# EAGLE schematic mubi-ESP32-38 (EAGLE 7.2.0)
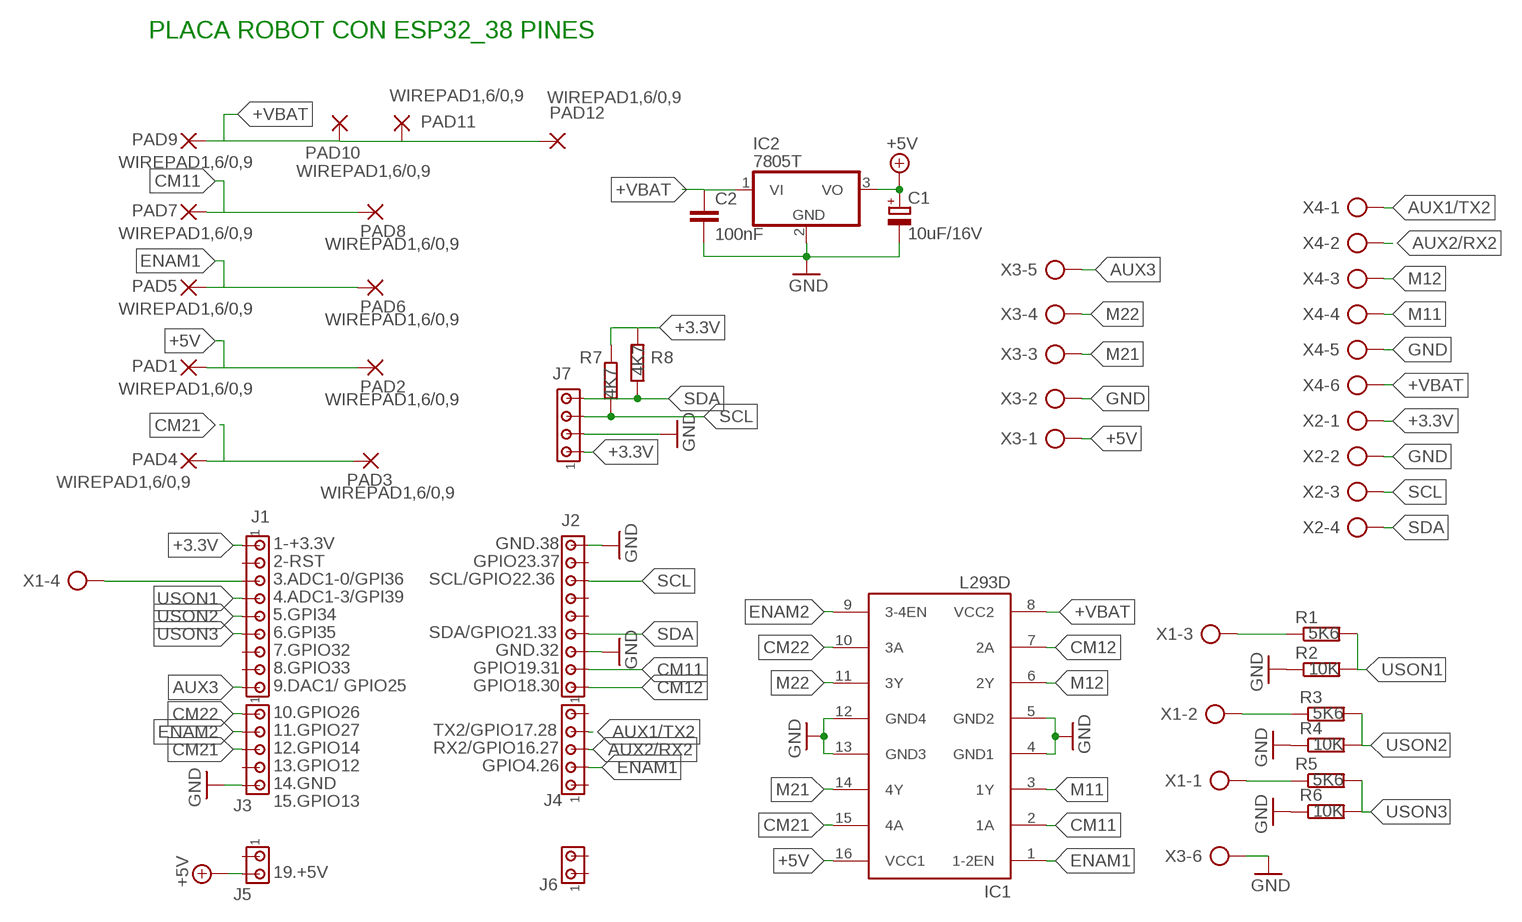
[diagram p0: schematic, sheet 1]

## Parts
C1  10uF/16V  CPOL-EUE2.5-6  [E2,5-6]
C2  100nF  C-EU025-025X050  [C025-025X050]
IC1  L293D  [DIL16]
IC2  7805T  [TO220H]
J1  MTA09-100  [10X09MTA]
J2  MTA09-100  [10X09MTA]
J3  MTA05-100  [10X05MTA]
J4  MTA05-100  [10X05MTA]
J5  MTA02-100  [10X02MTA]
J6  MTA02-100  [10X02MTA]
J7  MTA04-100  [10X04MTA]
PAD1  WIREPAD1,6/0,9  [1,6/0,9]
PAD2  WIREPAD1,6/0,9  [1,6/0,9]
PAD3  WIREPAD1,6/0,9  [1,6/0,9]
PAD4  WIREPAD1,6/0,9  [1,6/0,9]
PAD5  WIREPAD1,6/0,9  [1,6/0,9]
PAD6  WIREPAD1,6/0,9  [1,6/0,9]
PAD7  WIREPAD1,6/0,9  [1,6/0,9]
PAD8  WIREPAD1,6/0,9  [1,6/0,9]
PAD9  WIREPAD1,6/0,9  [1,6/0,9]
PAD10  WIREPAD1,6/0,9  [1,6/0,9]
PAD11  WIREPAD1,6/0,9  [1,6/0,9]
PAD12  WIREPAD1,6/0,9  [1,6/0,9]
R1  5K6  R-EU_0204/5  [0204/5]
R2  10K  R-EU_0204/5  [0204/5]
R3  5K6  R-EU_0204/5  [0204/5]
R4  10K  R-EU_0204/5  [0204/5]
R5  5K6  R-EU_0204/5  [0204/5]
R6  10K  R-EU_0204/5  [0204/5]
R7  4K7  R-EU_0207/7  [0207/7]
R8  4K7  R-EU_0207/7  [0207/7]
X1  AK500/4-H  [AK500/4-H]
X2  AK500/4-H  [AK500/4-H]
X3  AK500/6-H  [AK500/6-H]
X4  AK500/6-H  [AK500/6-H]

## Nets
+3.3V: J1.1 J7.1 R7.2 R8.2 X2.1
+5V: C1.+ IC1.16(VCC1) IC2.3(VO) J5.2 PAD1.1(P) PAD2.1(P) X3.1
+VBAT: C2.1 IC1.8(VCC2) IC2.1(VI) PAD9.1(P) PAD10.1(P) PAD11.1(P) PAD12.1(P) X4.6
AUX1/TX2: J4.4 X4.1
AUX2/RX2: J4.3 X4.2
AUX3: J1.9 X3.5
CM11: IC1.2(1A) J2.2 PAD7.1(P) PAD8.1(P)
CM12: IC1.7(2A) J2.1
CM21: IC1.15(4A) J3.3 PAD3.1(P) PAD4.1(P)
CM22: IC1.10(3A) J3.1
ENAM1: IC1.1(1-2EN) J4.2 PAD5.1(P) PAD6.1(P)
ENAM2: IC1.9(3-4EN) J3.2
GND: C1.- C2.2 IC1.4(GND1) IC1.5(GND2) IC1.12(GND4) IC1.13(GND3) IC2.2(GND) J2.3 J2.9 J3.5 J7.2 R2.1 R4.1 R6.1 X2.2 X3.2 X3.6 X4.5
M11: IC1.3(1Y) X4.4
M12: IC1.6(2Y) X4.3
M21: IC1.14(4Y) X3.3
M22: IC1.11(3Y) X3.4
N$1: R1.1 X1.3
N$2: R3.1 X1.2
N$3: R5.1 X1.1
N$4: J1.3 X1.4
SCL: J2.7 J7.3 R7.1 X2.3
SDA: J2.4 J7.4 R8.1 X2.4
USON1: J1.4 R1.2 R2.2
USON2: J1.5 R3.2 R4.2
USON3: J1.6 R5.2 R6.2
Unconnected: J1.2 J1.7 J1.8 J2.5 J2.6 J2.8 J3.4 J4.1 J4.5 J5.1 J6.1 J6.2

## Notes on the sheet
- PLACA ROBOT CON ESP32_38 PINES
- 1-+3.3V | GND.38
- 2-RST | GPIO23.37
- 3.ADC1-0/GPI36 | SCL/GPIO22.36
- 4.ADC1-3/GPI39
- 5.GPI34
- 6.GPI35 | SDA/GPIO21.33
- 7.GPIO32 | GND.32
- 8.GPIO33 | GPIO19.31
- 9.DAC1/ GPIO25 | GPIO18.30
- 10.GPIO26
- 11.GPIO27 | TX2/GPIO17.28
- 12.GPIO14 | RX2/GPIO16.27
- 13.GPIO12 | GPIO4.26
- 14.GND
- 15.GPIO13
- 19.+5V

## Library data of the parts
C1 = resistor:CPOL-EU: POLARIZED CAPACITOR, European symbol
C2 = rcl:C-EU: CAPACITOR, European symbol
IC1 = st-microelectronics:L293D: PUSH-PULL 4 CHANNEL DRIVER; MPN: L293D; OC_FARNELL: 9589619; OC_NEWARK: 56P8249
IC2 = linear:78*: Positive VOLTAGE REGULATOR Source: http://cache.national.com/ds/LM/LM78L05.pdf http://www.fairchildsemi.com/ds/LM/LM7805.pdf
J1 J2 = con-amp:MTA09-100: AMP connector
J3 J4 = con-amp:MTA05-100: AMP connector
J5 J6 = con-amp:MTA02-100: AMP connector
J7 = con-amp:MTA04-100: AMP connector
PAD1-PAD12 = wirepad:WIREPAD: Wire PAD connect wire on PCB
R1-R8 = resistor:R-EU_: RESISTOR, European symbol
X1 X2 = con-ptr500:AK500/4-H: CONNECTOR Aug. 2004 / PTR Meßtechnik: Die Bezeichnung der Serie AK505 wurde geändert. Es handelt sich hierbei um AK500 in horizontaler Ausführung.; OC_FARNELL: unknown; OC_NEWARK: unknown
X3 X4 = con-ptr500:AK500/6-H: CONNECTOR Aug. 2004 / PTR Meßtechnik: Die Bezeichnung der Serie AK505 wurde geändert. Es handelt sich hierbei um AK500 in horizontaler Ausführung.